# Altium schematic sheet RPI.SchDoc
size A3; SheetNumber: 3; SheetTotal: 5
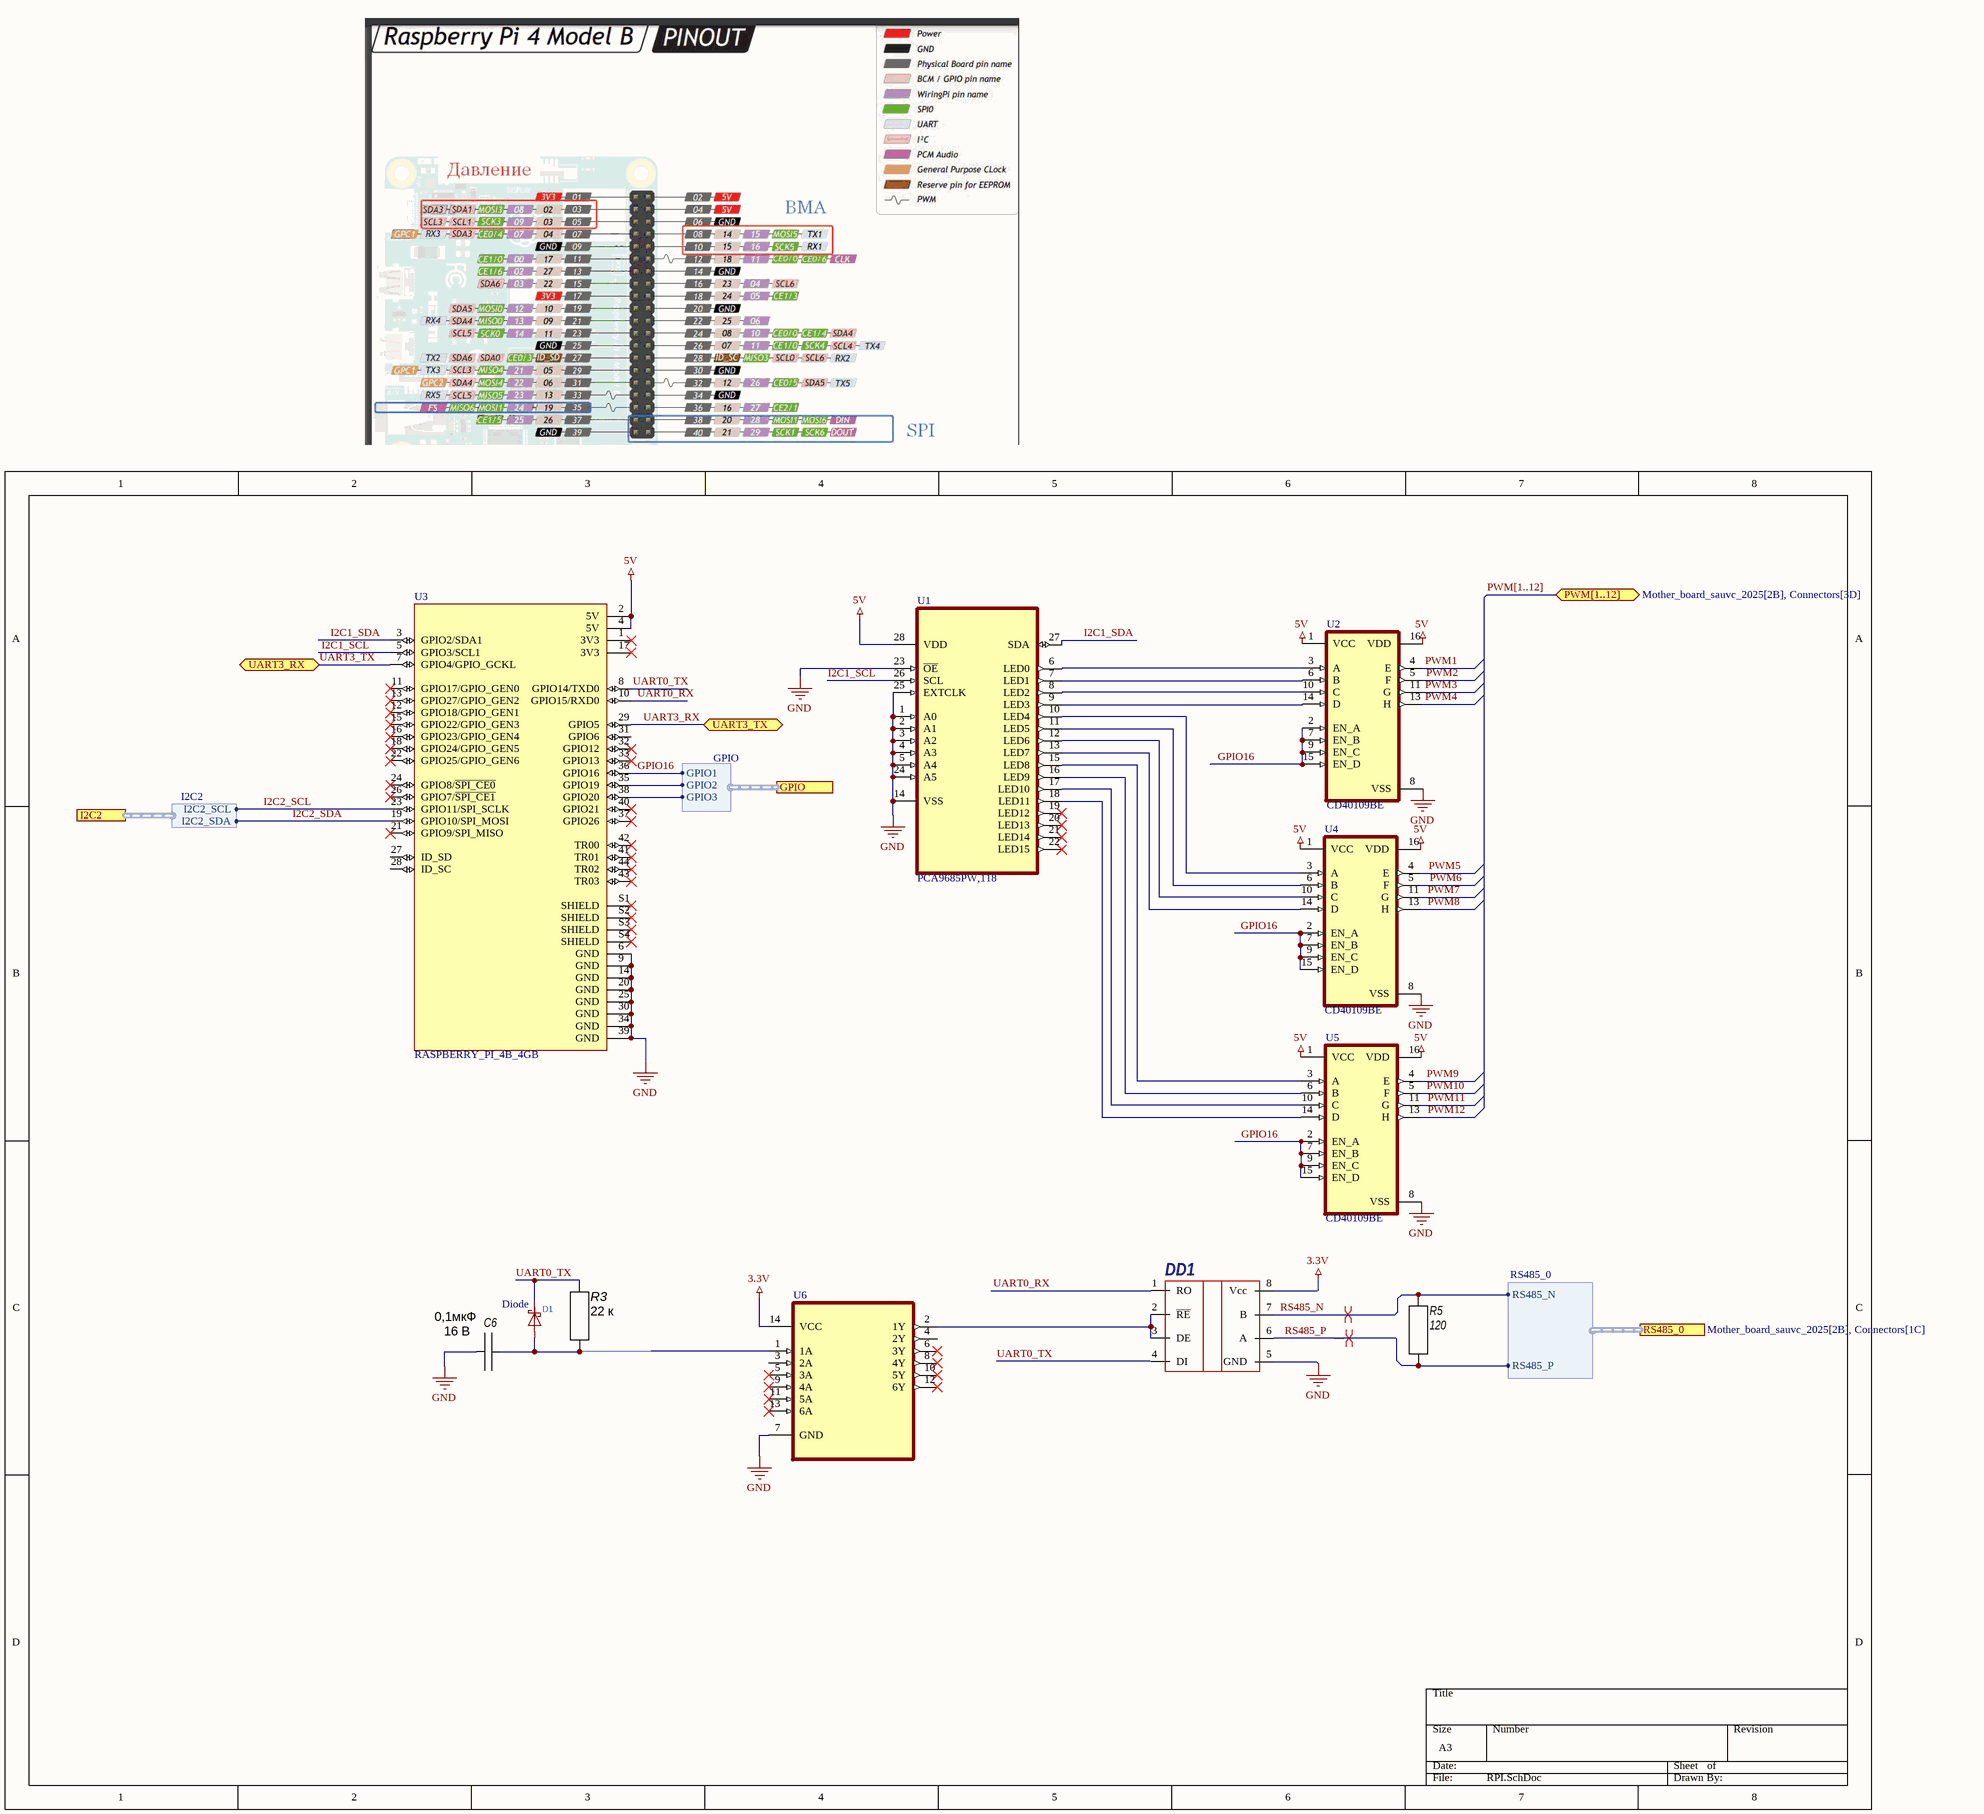
[diagram p0: RPI.SchDoc]

## Parts
C6  Voltage: 16 В  [C0603C]  (hidden comment: 0,1мкФ)
D1  Diode  [SOD-123F]
DD1  (no value)  [SOIC8N]
R3  22 к  [C0603R]
R5  120  [C0603R]
U1  PCA9685PW,118  [SOP65P640X110-28N]
U2  CD40109BE  [DIP794W45P254L1969H508Q16]
U3  RASPBERRY_PI_4B_4GB  [PLD40]
U4  CD40109BE  [DIP794W45P254L1969H508Q16]
U5  CD40109BE  [DIP794W45P254L1969H508Q16]
U6  (no value)  [SOIC127P600X175-14N]

## Ports
GPIO (harness GPIO, see Mother_board_sauvc_2025[2B], Connectors[1C]), I2C2 (harness I2C2, see Mother_board_sauvc_2025[2B], Connectors[3B]), PWM[1..12] (bidir, see Mother_board_sauvc_2025[2B], Connectors[3D]), RS485_0 (harness RS485_0, see Mother_board_sauvc_2025[2B], Connectors[1C]), UART3_RX (bidir, see Mother_board_sauvc_2025[2B], Connectors[3C]), UART3_TX (bidir, see Mother_board_sauvc_2025[2B], Connectors[3C])

## Harnesses
I2C2: I2C2_SCL, I2C2_SDA
GPIO: GPIO2, GPIO3, GPIO1
RS485_0: RS485_N, RS485_P

## Nets
3.3V: DD1.8(Vcc) U6.14(VCC)
5V: U1.28(VDD) U2.1(VCC) U2.16(VDD) U3.2(5V) U3.4(5V) U4.1(VCC) U4.16(VDD) U5.1(VCC) U5.16(VDD)
GND: C6.2 DD1.5(GND) U1.1(A0) U1.2(A1) U1.3(A2) U1.4(A3) U1.5(A4) U1.14(VSS) U1.23(~{OE}) U1.24(A5) U1.25(EXTCLK) U2.8(VSS) U3.6(GND) U3.9(GND) U3.14(GND) U3.20(GND) U3.25(GND) U3.30(GND) U3.34(GND) U3.39(GND) U4.8(VSS) U5.8(VSS) U6.7(GND)
GPIO16: U2.2(EN_A) U2.7(EN_B) U2.9(EN_C) U2.15(EN_D) U3.36(GPIO16) U4.2(EN_A) U4.7(EN_B) U4.9(EN_C) U4.15(EN_D) U5.2(EN_A) U5.7(EN_B) U5.9(EN_C) U5.15(EN_D) ; port GPIO.GPIO1
I2C1_SCL: U1.26(SCL) U3.5(GPIO3/SCL1)
I2C1_SDA: U1.27(SDA) U3.3(GPIO2/SDA1)
I2C2_SCL: U3.23(GPIO11/SPI_SCLK) ; port I2C2.I2C2_SCL
I2C2_SDA: U3.19(GPIO10/SPI_MOSI) ; port I2C2.I2C2_SDA
PWM1: U2.4(E)
PWM2: U2.5(F)
PWM3: U2.11(G)
PWM4: U2.13(H)
PWM5: U4.4(E)
PWM6: U4.5(F)
PWM7: U4.11(G)
PWM8: U4.13(H)
PWM9: U5.4(E)
PWM10: U5.5(F)
PWM11: U5.11(G)
PWM12: U5.13(H)
RS485_N: DD1.7(B) R5.1 ; port RS485_0.RS485_N
RS485_P: DD1.6(A) R5.2 ; port RS485_0.RS485_P
UART0_RX: DD1.1(RO) U3.10(GPIO15/RXD0)
UART0_TX: D1.K DD1.4(DI) R3.1 U3.8(GPIO14/TXD0)
UART3_RX: U3.29(GPIO5) ; port UART3_TX
UART3_TX: U3.7(GPIO4/GPIO_GCKL) ; port UART3_RX
NetC6_1: C6.1 D1.A R3.2 U6.1(1A)
NetDD1_2: DD1.2(~{RE}) DD1.3(DE) U6.2(1Y)
NetU1_6: U1.6(LED0) U2.3(A)
NetU1_7: U1.7(LED1) U2.6(B)
NetU1_8: U1.8(LED2) U2.10(C)
NetU1_9: U1.9(LED3) U2.14(D)
NetU1_10: U1.10(LED4) U4.3(A)
NetU1_11: U1.11(LED5) U4.6(B)
NetU1_12: U1.12(LED6) U4.10(C)
NetU1_13: U1.13(LED7) U4.14(D)
NetU1_15: U1.15(LED8) U5.3(A)
NetU1_16: U1.16(LED9) U5.6(B)
NetU1_17: U1.17(LED10) U5.10(C)
NetU1_18: U1.18(LED11) U5.14(D)
NetU3_35: U3.35(GPIO19) ; port GPIO.GPIO2
NetU3_38: U3.38(GPIO20) ; port GPIO.GPIO3

Not connected (* = marked no-connect by the designer): U1 19(LED12)* 20(LED13)* 21(LED14)* 22(LED15)*; U3 1(3V3)* 11(GPIO17/GPIO_GEN0)* 12(GPIO18/GPIO_GEN1)* 13(GPIO27/GPIO_GEN2)* 15(GPIO22/GPIO_GEN3)* 16(GPIO23/GPIO_GEN4)* 17(3V3)* 18(GPIO24/GPIO_GEN5)* 21(GPIO9/SPI_MISO)* 22(GPIO25/GPIO_GEN6)* 24(GPIO8/~{SPI_CE0})* 26(GPIO7/~{SPI_CE1})* 27(ID_SD) 28(ID_SC) 31(GPIO6) 32(GPIO12)* 33(GPIO13)* 37(GPIO26)* 40(GPIO21)* 41(TR01)* 42(TR00)* 43(TR03)* 44(TR02)* S1(SHIELD)* S2(SHIELD)* S3(SHIELD)* S4(SHIELD)*; U6 3(2A) 4(2Y) 5(3A)* 6(3Y)* 8(4Y)* 9(4A)* 10(5Y)* 11(5A)* 12(6Y)* 13(6A)*

## Buses and harness runs
bus PWM[1..12] = port PWM[1..12]

## Layout directives
differential pair: RS485_N, RS485_P

## Library data of the parts
C6 = CL10B152KB8NNNC: SMD 0603 ; X7R; 1,5 нФ; 50 В; Manufacturer: SAMSUNG; Persent: ±15%; Type: Ceramic; Part Number: CL10B152KB8NNNC; Package: SMD 0603; Dielectric: X7R; ComponentLink1Description: Datasheet; Value: 0,1мкФ
D1 = Schottky-Diode: ki_description: Schottky Diode; Datasheet: https://diotec.com/de/produktliste/SBD.html; ki_keywords: Schottky
DD1 = MAX3072E: Half-duplex; Manufacturer: MAXIM; Rate: 3.3v; Notice: True fail-safe; Datasheet: https://static.chipdip.ru/lib/276/DOC000276899.pdf; Shop: https://www.chipdip.ru/product/max3072eesa; Case: soic-8(0.154 inch)
R3 = RC0603FR-0722KL: SMD 0603; 0,1; 1%; 22 кОм; Manufacturer: Yageo; Power: 0,1; TCR: 200 ppm; Part Number: RC0603FR-0722KL; Package: SMD 0603; Persent: 1%; Category: R; Value: 22 к
R5 = RC0603FR-07120RL: SMD 0603; 0,1; 1%; 120 Ом; Manufacturer: Yageo; Power: 0,1; TCR: 200 ppm; Part Number: RC0603FR-07120RL; Package: SMD 0603; Persent: 1%; Value: 120; Category: R
U1 = PCA9685PW,118: LED Driver IC 16 Output Linear - PWM Dimming 25mA 28-TSSOP; MF: NXP USA; Value: *; MP: PCA9685PW,118; Purchase-URL: https://pricing.snapeda.com/search/part/PCA9685PW,118/?ref=eda; Availability: In Stock; Price: None; Package: TSSOP-28 NXP Semiconductors
U2 U4 U5 = CD40109BE: Ð§ÐµÑ‚Ñ‹Ñ€ÐµÑ…ÑŠÑÐ´ÐµÑ€Ð½Ñ‹Ð¹ ÐšÐœÐžÐŸ-Ð¿Ñ€ÐµÐ¾Ð±Ñ€Ð°Ð·Ð¾Ð²Ð°Ñ‚ÐµÐ»ÑŒ Ð½Ð¸Ð·ÐºÐ¾Ð³Ð¾ Ð½Ð°Ð¿Ñ€ÑÐ¶ÐµÐ½Ð¸Ñ Ð² Ð²Ñ‹ÑÐ¾ÐºÐ¾Ðµ (Ð½Ð¾Ð¼Ð¸Ð½Ð°Ð»ÑŒÐ½Ð¾Ðµ Ð½Ð°Ð¿Ñ€ÑÐ¶ÐµÐ½Ð¸Ðµ 20 Ð’); MF: Texas Instruments; SnapEDA_Link: https://www.snapeda.com/parts/CD40109BE/Texas+Instruments/view-part/?ref=snap; Package: PDIP-16 Texas Instruments; Value: *; MP: CD40109BE; Check_prices: https://www.snapeda.com/parts/CD40109BE/Texas+Instruments/view-part/?ref=eda
U3 = RASPBERRY_PI_4B_4GB: BCM2711 Raspberry Pi 4 Model B 4GB - ARMÂ® CortexÂ®-A72 MPU Embedded Evaluation Board; MP: RASPBERRY PI 4B/4GB; Price: None; MF: Raspberry Pi; Check_prices: https://www.snapeda.com/parts/RASPBERRY%20PI%204B/4GB/Raspberry+Pi/view-part/?ref=eda; Value: *; Purchase-URL: https://pricing.snapeda.com/search/part/RASPBERRY PI 4B/4GB/?ref=eda; Availability: In Stock; SnapEDA_Link: https://www.snapeda.com/parts/RASPBERRY%20PI%204B/4GB/Raspberry+Pi/view-part/?ref=snap; Package: None
U6 = 74HC14D: Inverter IC 6 Channel Schmitt Trigger 14-SOIC; MF: Toshiba; SnapEDA_Link: https://www.snapeda.com/parts/74HC14D/Toshiba+Semiconductor+and+Storage/view-part/?ref=snap; Availability: In Stock; Price: None; Package: SO14-14 Nexperia USA Inc.; Purchase-URL: https://pricing.snapeda.com/search/part/74HC14D/?ref=eda; Check_prices: https://www.snapeda.com/parts/74HC14D/Toshiba+Semiconductor+and+Storage/view-part/?ref=eda; Value: *; MP: 74HC14D